# EAGLE design activeIr (EAGLE 7.6.0)
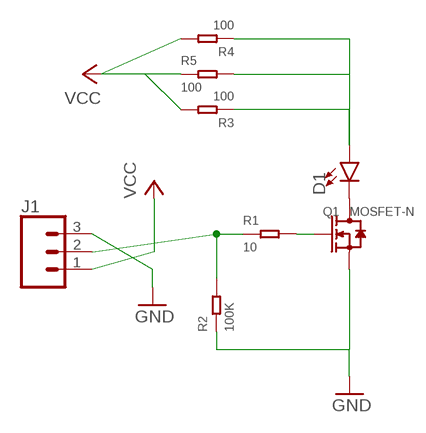
[diagram p0: schematic, sheet 1]

## Parts
D1  LED5MM  [LED_5MM]
J1  CONN_03SMD_RA_MALE  [1X03_SMD_RA_MALE]
Q1  MOSFET-N  [SOT-23]
R1  10  RES-0603  [R0603]
R2  100K  RES-0603  [R0603]
R3  100  RES-1206  [R1206]
R4  100  RES-1206  [R1206]
R5  100  RES-1206  [R1206]

## Nets
GND: J1.3 Q1.2(S) R2.1
N$1: D1.K(C) Q1.3(D)
N$2: Q1.1(G) R1.2
N$3: D1.A R3.1 R4.1 R5.2
SIGNAL: J1.2 R1.1 R2.2
VCC: J1.1 R3.2 R4.2 R5.1

## Library data of the parts
D1 = SparkFun-LED:LED: LED (Generic) Standard schematic elements and footprints for 5mm, 3mm, 1206, and 0603 sized LEDs. Generic LEDs with no color specified.
J1 = SparkFun-Connectors:CONN_03: Multi connection point. Often used as Generic Header-pin footprint for 0.1 inch spaced/style header connections On any of the 0.1 inch spaced packages, you can populate with these: Break Away Headers - Straight <https://www.sparkfun.com/products/116> (PRT-00116) Break Away Male Headers - Right Angle <https://www.sparkfun.com/products/553> (PRT-00553) Female Headers <https://www.sparkfun.com/products/115> (PRT-00115) Break Away Headers - Machine Pin <https://www.sparkfun.com/products/117> (PRT-00117) Break Away Female Headers - Swiss Machine Pin <https://www.sparkfun.com/products/743> (PRT-00743) Stackable Header - 3 Pin (Female, 0.1") <https://www.sparkfun.com/products/13875> (PRT-13875) For SCREWTERMINALS and SPRING TERMINALS visit here: Screw Terimnals on SparkFun.com <https://www.sparkfun.com/search/results?term=Screw+Terminals> (5mm/3.5mm/2.54mm spacing) This device is also useful as a general connection point to wire up your design to another part of your project. Our various solder wires solder well into these plated through hole pads. Hook-Up Wire - Assortment (Stranded, 22 AWG) <https://www.sparkfun.com/products/11375> (PRT-11375) Hook-Up Wire - Assortment (Solid Core, 22 AWG) <https://www.sparkfun.com/products/11367> (PRT-11367) View the entire wire category on our website here <https://www.sparkfun.com/categories/141> Special notes: Molex polarized connector foot print use with SKU : PRT-08232 with associated crimp pins and housings.; PROD_ID: CONN-10925
Q1 = Seeed-OPL-Transistor:MOSFET-N
R1-R5 = Seeed-OPL-Resistor:RES

## Board
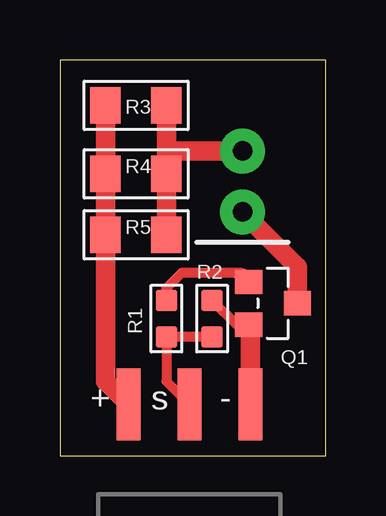
[diagram p1: board, top side]
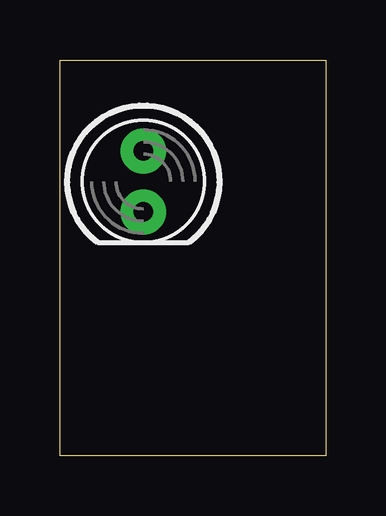
[diagram p2: board, bottom side, seen from below]

Size 11.1 x 16.5 mm. Coordinates in mm from the lower left corner, seen from the top.
Outline: 0,0 11.1,0 11.1,16.5 0,16.5 0,0
Copper layers (1*16): Top 0.035mm / dielectric 1.5mm / Bottom 0.035mm
Design rules "SeeedStudio_2layer_DRU_no_angle_20140221": minimum track width 6mil, minimum drill 12mil, track to track 6mil, track to pad 6mil, pad to pad 6mil, via to via 6mil, smd to smd 0mil, copper to edge 10mil, drill to drill 10mil, minimum pad ring 10mil, minimum via ring 6mil, stop-mask expansion 2mil, vias tented up to drill 100mil, thermal gap 10mil

### Footprints (pad centres in the part's own frame; a part is rotated, then mirrored left to right if it is on the bottom)
LED_5MM = drill 0.813 pad 1.88: A -1.27,0; K 1.27,0
1X03_SMD_RA_MALE = smd 1 x 3: 1 -2.54,5; 2 0,5; 3 2.54,5
SOT-23 = smd 1.016 x 1.143: 1 -0.889,-1.016; 2 0.889,-1.016; 3 0,1.016
R0603 = smd 0.889 x 0.889: 1 0,0.762; 2 0,-0.762
R1206 = smd 1.27 x 1.524: 1 -1.27,0; 2 1.27,0

### Placement (x,y rotation side)
D1  7.62,11.43 270 bottom
J1  5.4,-2.86 0 top
Q1  8.89,6.35 270 top
R1  4.45,5.71 180 top
R2  6.35,5.71 0 top
R3  3.17,14.61 180 top
R4  3.17,11.75 180 top
R5  3.17,9.21 0 top

### Tracks (layer width: path | path; a pad name or v marks a point on that pad's centre or on a via)
GND
  Top 0.406: R2.1 7.37,5.46 Q1.2
  Top 0.813: Q1.2 7.94,5.4 J1.3
N$1
  Top 0.813: Q1.3 9.91,7.87 D1.K
N$2
  Top 0.406: Q1.1 arc90 7.49,7.62 5.08,7.62 4.45,6.99 R1.2
N$3
  Top 0.813: R5.2 R4.1 R3.1 4.45,12.7 D1.A
SIGNAL
  Top 0.406: R2.2 R1.1 4.45,3.1 J1.2
VCC
  Top 0.813: R3.2 R4.2 R5.1 1.91,3.1 J1.1

### Text on the board
tPlace: + | s | -